# EAGLE design Slave Mux (EAGLE 9.6.2)
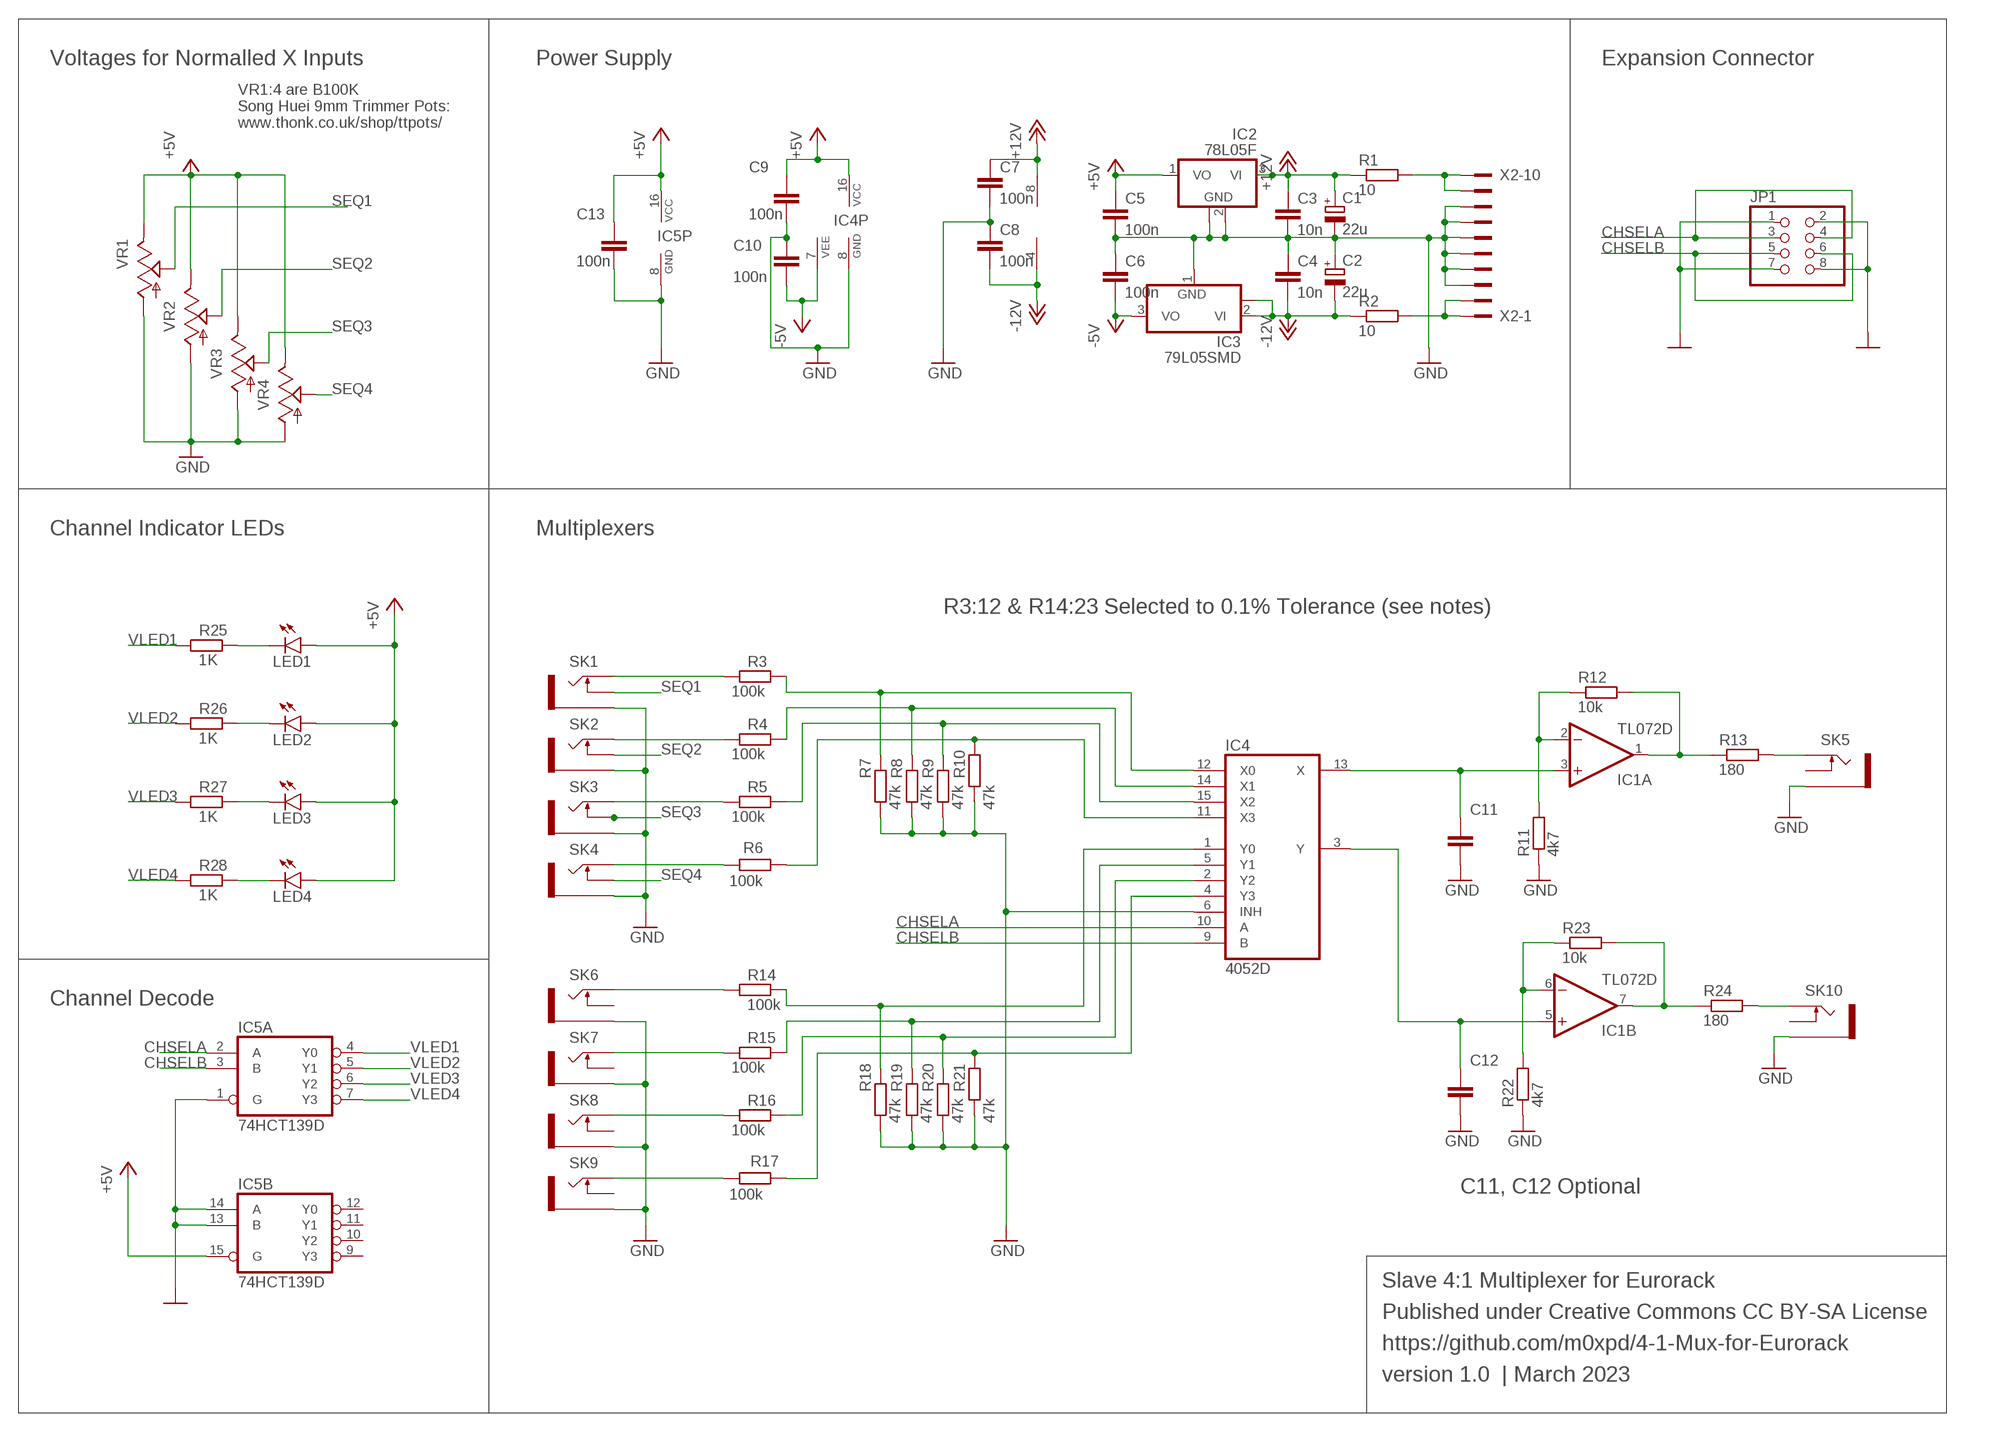
[diagram p0: schematic, sheet 1]

## Parts
C1  22u  CPOL-EU153CLV-0505  [153CLV-0505]
C2  22u  CPOL-EU153CLV-0505  [153CLV-0505]
C3  10n  C-EUC1206  [C1206]
C4  10n  C-EUC1206  [C1206]
C5  100n  C-EUC1206  [C1206]
C6  100n  C-EUC1206  [C1206]
C7  100n  C-EUC1206  [C1206]
C8  100n  C-EUC1206  [C1206]
C9  100n  C-EUC1206  [C1206]
C10  100n  C-EUC1206  [C1206]
C11  C-EUC1206  [C1206]
C12  C-EUC1206  [C1206]
C13  100n  C-EUC1206  [C1206]
IC1  TL072D  [SO08]
IC2  78L05F  [SOT89]
IC3  79L05SMD  [SOT89]
IC4  4052D  [SO16]
IC5  74HCT139D  [SO16]
JP1  PINHD-2X4  [2X04]
LED1  LED3MM  [LED3MM]
LED2  LED3MM  [LED3MM]
LED3  LED3MM  [LED3MM]
LED4  LED3MM  [LED3MM]
R1  10  R-EU_M1206  [M1206]
R2  10  R-EU_M1206  [M1206]
R3  100k  R-EU_M1206  [M1206]
R4  100k  R-EU_M1206  [M1206]
R5  100k  R-EU_M1206  [M1206]
R6  100k  R-EU_M1206  [M1206]
R7  47k  R-EU_M1206  [M1206]
R8  47k  R-EU_M1206  [M1206]
R9  47k  R-EU_M1206  [M1206]
R10  47k  R-EU_M1206  [M1206]
R11  4k7  R-EU_R1206  [R1206]
R12  10k  R-EU_R1206  [R1206]
R13  180  R-EU_M1206  [M1206]
R14  100k  R-EU_M1206  [M1206]
R15  100k  R-EU_M1206  [M1206]
R16  100k  R-EU_M1206  [M1206]
R17  100k  R-EU_M1206  [M1206]
R18  47k  R-EU_M1206  [M1206]
R19  47k  R-EU_M1206  [M1206]
R20  47k  R-EU_M1206  [M1206]
R21  47k  R-EU_M1206  [M1206]
R22  4k7  R-EU_R1206  [R1206]
R23  10k  R-EU_R1206  [R1206]
R24  180  R-EU_M1206  [M1206]
R25  1K  R-EU_M1206  [M1206]
R26  1K  R-EU_M1206  [M1206]
R27  1K  R-EU_M1206  [M1206]
R28  1K  R-EU_M1206  [M1206]
SK1  THONKICONN_JACK  [WQP-PJ301M-12_JACK]
SK2  THONKICONN_JACK  [WQP-PJ301M-12_JACK]
SK3  THONKICONN_JACK  [WQP-PJ301M-12_JACK]
SK4  THONKICONN_JACK  [WQP-PJ301M-12_JACK]
SK5  THONKICONN_JACK  [WQP-PJ301M-12_JACK]
SK6  THONKICONN_JACK  [WQP-PJ301M-12_JACK]
SK7  THONKICONN_JACK  [WQP-PJ301M-12_JACK]
SK8  THONKICONN_JACK  [WQP-PJ301M-12_JACK]
SK9  THONKICONN_JACK  [WQP-PJ301M-12_JACK]
SK10  THONKICONN_JACK  [WQP-PJ301M-12_JACK]
VR1  9MM_VERTICAL_POT  [9MM_SNAP-IN_POT]
VR2  9MM_VERTICAL_POT  [9MM_SNAP-IN_POT]
VR3  9MM_VERTICAL_POT  [9MM_SNAP-IN_POT]
VR4  9MM_VERTICAL_POT  [9MM_SNAP-IN_POT]
X2  2510-  [PAK100/2500-10]

## Nets
+5V: C5.1 C9.1 C13.1 IC2.1(VO) IC4.16(VCC) IC5.15(B:G) IC5.16(P:VCC) LED1.A LED2.A LED3.A LED4.A VR1.3(E) VR2.3(E) VR3.3(E) VR4.3(E)
+12V: C1.+ C3.1 C7.1 IC1.8(P:V+) IC2.3(VI) R1.1
-5V: C6.2 C10.2 IC3.3(VO) IC4.7(VEE)
-12V: C2.- C4.2 C8.2 IC1.4(P:V-) IC3.2(VI) IC3.2@1(VI) R2.1
CHSELA: IC4.10(A) IC5.2(A:A) JP1.3 JP1.4
CHSELB: IC4.9(B) IC5.3(A:B) JP1.5 JP1.6
GND: C1.- C2.+ C3.2 C4.1 C5.2 C6.1 C7.2 C8.1 C9.2 C10.1 C11.2 C12.2 C13.2 IC2.2(GND) IC2.2@1(GND) IC3.1(GND) IC4.6(INH) IC4.8(GND) IC5.1(A:G) IC5.8(P:GND) IC5.13(B:B) IC5.14(B:A) JP1.1 JP1.2 JP1.7 JP1.8 R7.1 R8.1 R9.1 R10.1 R11.1 R18.1 R19.1 R20.1 R21.1 R22.1 SK1.P$3_SLEEVE(SLEEVE) SK2.P$3_SLEEVE(SLEEVE) SK3.P$3_SLEEVE(SLEEVE) SK4.P$3_SLEEVE(SLEEVE) SK5.P$3_SLEEVE(SLEEVE) SK6.P$3_SLEEVE(SLEEVE) SK7.P$3_SLEEVE(SLEEVE) SK8.P$3_SLEEVE(SLEEVE) SK9.P$3_SLEEVE(SLEEVE) SK10.P$3_SLEEVE(SLEEVE) VR1.1(A) VR2.1(A) VR3.1(A) VR4.1(A) X2.3 X2.4 X2.5 X2.6 X2.7 X2.8
N$1: IC4.12(X0) R3.2 R7.2
N$2: IC4.14(X1) R4.2 R8.2
N$3: IC4.15(X2) R5.2 R9.2
N$4: C11.1 IC1.3(A:+IN) IC4.13(X)
N$5: IC1.2(A:-IN) R11.2 R12.1
N$6: IC1.1(A:OUT) R12.2 R13.1
N$7: R3.1 SK1.P$1_TIP(TIP)
N$8: IC4.11(X3) R6.1 R10.2
N$9: R4.1 SK2.P$1_TIP(TIP)
N$10: R5.1 SK3.P$1_TIP(TIP)
N$11: R6.2 SK4.P$1_TIP(TIP)
N$12: LED1.K(C) R25.2
N$13: R13.2 SK5.P$1_TIP(TIP)
N$14: IC4.1(Y0) R14.2 R18.2
N$15: R1.2 X2.9 X2.10
N$16: R2.2 X2.1 X2.2
N$17: IC4.5(Y1) R15.2 R19.2
N$18: IC4.2(Y2) R16.2 R20.2
N$19: IC4.4(Y3) R17.1 R21.2
N$20: R14.1 SK6.P$1_TIP(TIP)
N$21: R15.1 SK7.P$1_TIP(TIP)
N$22: R16.1 SK8.P$1_TIP(TIP)
N$23: R17.2 SK9.P$1_TIP(TIP)
N$24: LED4.K(C) R28.2
N$25: C12.1 IC1.5(B:+IN) IC4.3(Y)
N$26: IC1.6(B:-IN) R22.2 R23.1
N$27: IC1.7(B:OUT) R23.2 R24.1
N$28: R24.2 SK10.P$1_TIP(TIP)
N$29: LED2.K(C) R26.2
N$30: LED3.K(C) R27.2
SEQ1: SK1.P$2_SWITCH(SWITCH) VR1.2(S)
SEQ2: SK2.P$2_SWITCH(SWITCH) VR2.2(S)
SEQ3: SK3.P$2_SWITCH(SWITCH) VR3.2(S)
SEQ4: SK4.P$2_SWITCH(SWITCH) VR4.2(S)
VLED1: IC5.4(A:Y0) R25.1
VLED2: IC5.5(A:Y1) R26.1
VLED3: IC5.6(A:Y2) R27.1
VLED4: IC5.7(A:Y3) R28.1
Unconnected: IC5.9(B:Y3) IC5.10(B:Y2) IC5.11(B:Y1) IC5.12(B:Y0) SK5.P$2_SWITCH(SWITCH) SK6.P$2_SWITCH(SWITCH) SK7.P$2_SWITCH(SWITCH) SK8.P$2_SWITCH(SWITCH) SK9.P$2_SWITCH(SWITCH) SK10.P$2_SWITCH(SWITCH)

## Notes on the sheet
- Voltages for Normalled X Inputs | Power Supply | Expansion Connector
- VR1:4 are B100K
  Song Huei 9mm Trimmer Pots:
  www.thonk.co.uk/shop/ttpots/
- Channel Indicator LEDs | Multiplexers
- R3:12 & R14:23 Selected to 0.1% Tolerance (see notes)
- Channel Decode
- C11, C12 Optional
- Slave 4:1 Multiplexer for Eurorack
- Published under Creative Commons CC BY-SA License
- https://github.com/m0xpd/4-1-Mux-for-Eurorack
- version 1.0  | March 2023

## Library data of the parts
C1 C2 = rcl:CPOL-EU: POLARIZED CAPACITOR, European symbol; SPICEPREFIX: C
C3-C13 = rcl:C-EU: CAPACITOR, European symbol; SPICEPREFIX: C
IC1 = linear:TL072: OP AMP
IC2 = linear:78L*: POSITOIV-VOLTAGE REGULATORS Output up to 100 mA Source: Datasheet <http://focus.ti.com/lit/ds/symlink/ua78l05.pdf>
IC3 = MyLibrary:79L05SMD: -5V Linear Regulator with 100mA output in SOT-89 Package
IC4 = 40xx:4052: Dual 4-channel ANALOG MULTIPLEXER
IC5 = 74xx-eu:74*139: Dual 2-line to 4-line DECODER/DEMULTIPLEXER
JP1 = pinhead:PINHD-2X4: PIN HEADER
LED1-LED4 = led:LED: LED OSRAM: - CHIPLED LG R971, LG N971, LY N971, LG Q971, LY Q971, LO R971, LY R971 LH N974, LH R974 LS Q976, LO Q976, LY Q976 LO Q996 - Hyper CHIPLED LW Q18S LB Q993, LB Q99A, LB R99A - SideLED LS A670, LO A670, LY A670, LG A670, LP A670 LB A673, LV A673, LT A673, LW A673 LH A674 LY A675 LS A676, LA A676, LO A676, LY A676, LW A676 LS A679, LY A679, LG A679 - Hyper Micro SIDELED® LS Y876, LA Y876, LO Y876, LY Y876 LT Y87S - SmartLED LW L88C, LW L88S LB L89C, LB L89S, LG L890 LS L89K, LO L89K, LY L89K LS L896, LA L896, LO L896, LY L896 - TOPLED LS T670, LO T670, LY T670, LG T670, LP T670 LSG T670, LSP T670, LSY T670, LOP T670, LYG T670 LG T671, LOG T671, LSG T671 LB T673, LV T673, LT T673, LW T673 LH T674 LS T676, LA T676, LO T676, LY T676, LB T676, LH T676, LSB T676, LW T676 LB T67C, LV T67C, LT T67C, LS T67K, LO T67K, LY T67K, LW E67C LS E67B, LA E67B, LO E67B, LY E67B, LB E67C, LV E67C, LT E67C LW T67C LS T679, LY T679, LG T679 LS T770, LO T770, LY T770, LG T770, LP T770 LB T773, LV T773, LT T773, LW T773 LH T774 LS E675, LA E675, LY E675, LS T675 LS T776, LA T776, LO T776, LY T776, LB T776 LHGB T686 LT T68C, LB T68C - Hyper Mini TOPLED® LB M676 - Mini TOPLED Santana® LG M470 LS M47K, LO M47K, LY M47K Source: http://www.osram.convergy.de LUXEON: - LUMILED® LXK2-PW12-R00, LXK2-PW12-S00, LXK2-PW14-U00, LXK2-PW14-V00 LXK2-PM12-R00, LXK2-PM12-S00, LXK2-PM14-U00 LXK2-PE12-Q00, LXK2-PE12-R00, LXK2-PE12-S00, LXK2-PE14-T00, LXK2-PE14-U00 LXK2-PB12-K00, LXK2-PB12-L00, LXK2-PB12-M00, LXK2-PB14-N00, LXK2-PB14-P00, LXK2-PB14-Q00 LXK2-PR12-L00, LXK2-PR12-M00, LXK2-PR14-Q00, LXK2-PR14-R00 LXK2-PD12-Q00, LXK2-PD12-R00, LXK2-PD12-S00 LXK2-PH12-R00, LXK2-PH12-S00 LXK2-PL12-P00, LXK2-PL12-Q00, LXK2-PL12-R00 Source: www.luxeon.com KINGBRIGHT: KA-3528ASYC Source: www.kingbright.com
R1-R28 = rcl:R-EU_: RESISTOR, European symbol; SPICEPREFIX: R
SK1-SK10 = MyLibrary:THONKICONN_JACK
VR1-VR4 = MyLibrary:9MM_VERTICAL_POT
X2 = con-3m:2510-: 3M (TM) Pak 100 4-Wall Header Source: 3M; MF: 3M; MPN: 2510-6002UB; OC_FARNELL: 9838244; OC_NEWARK: 46F4725

## Board
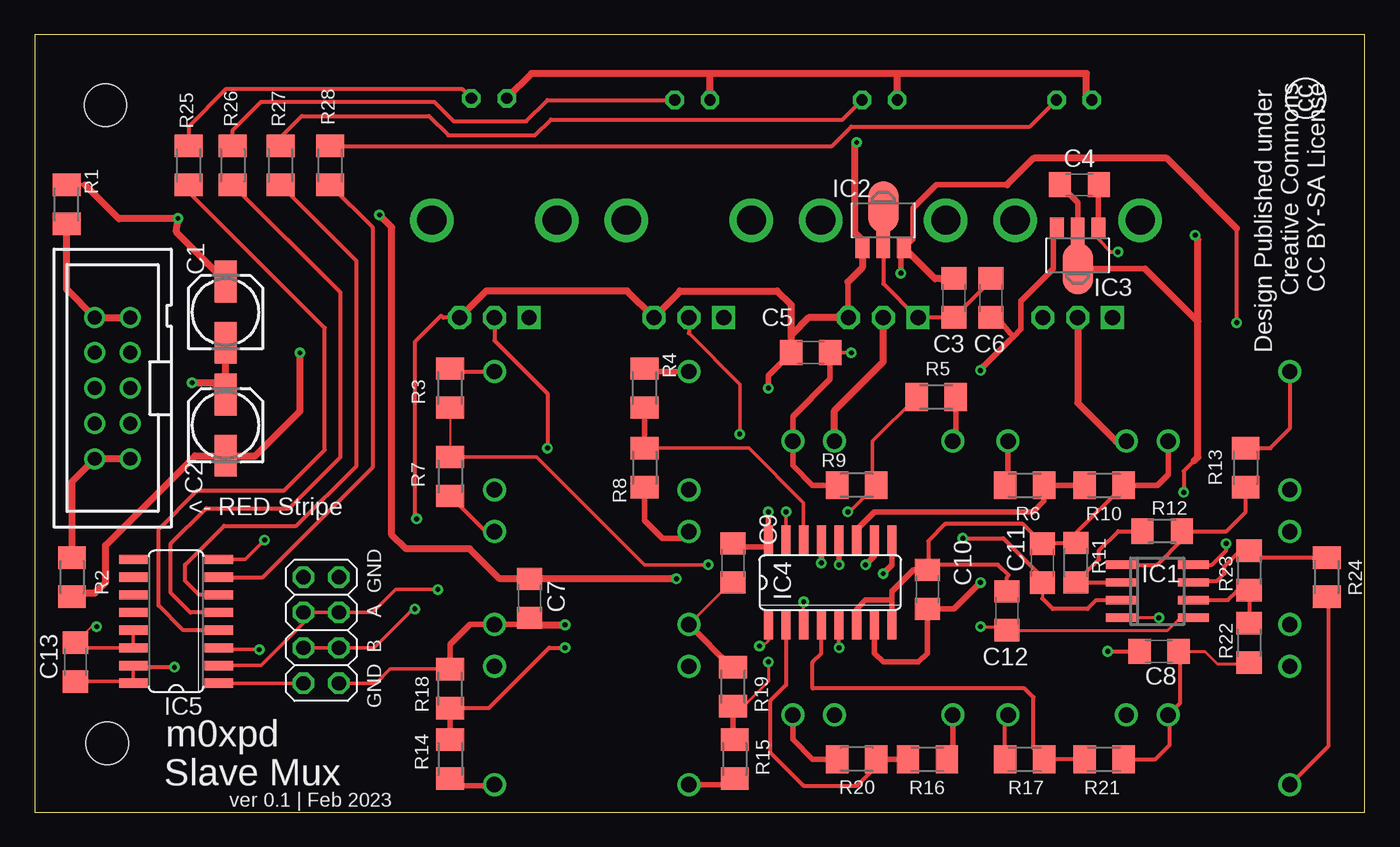
[diagram p1: board, top side]
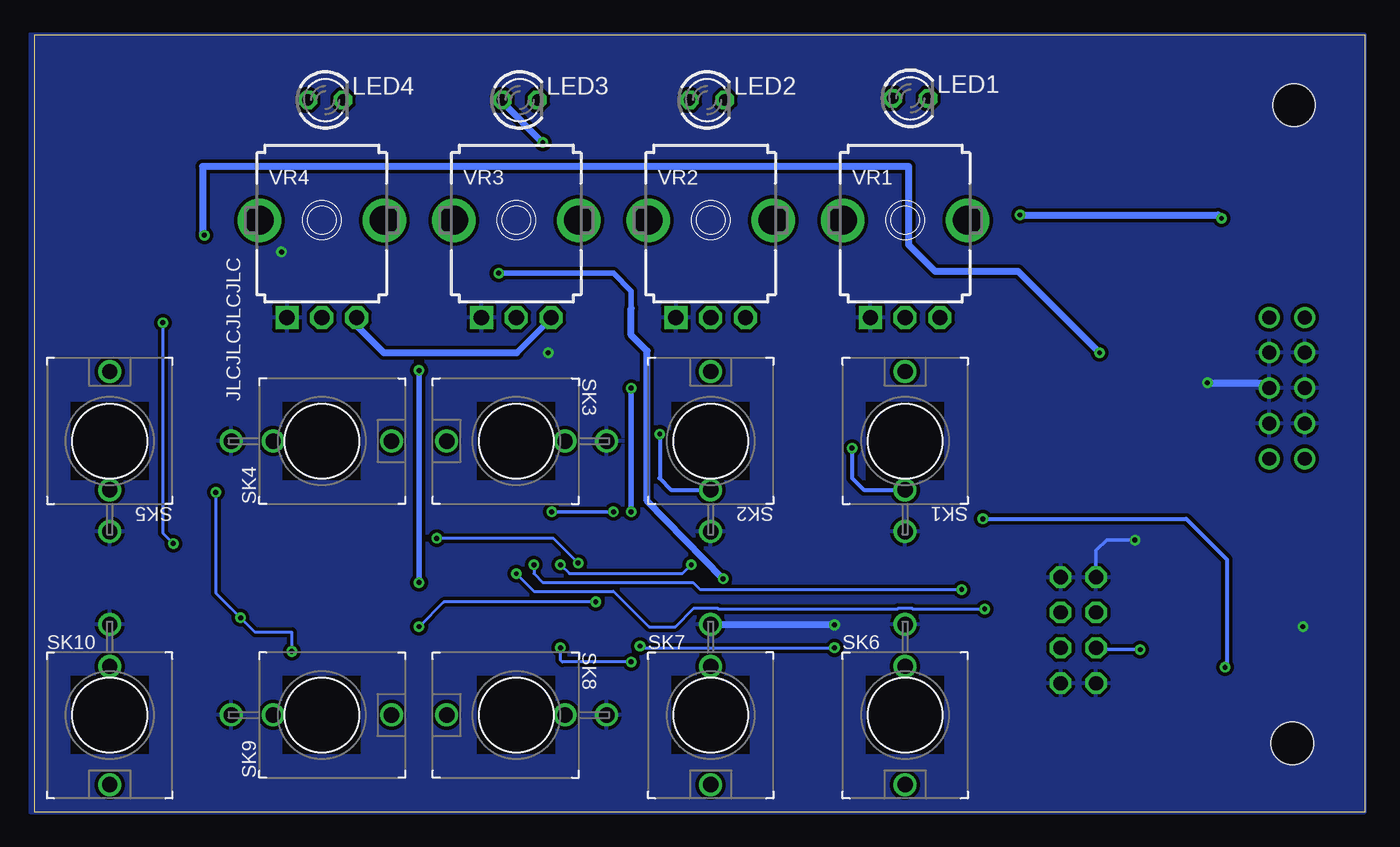
[diagram p2: board, bottom side, seen from below]

Size 95.56 x 55.87 mm. Coordinates in mm from the lower left corner, seen from the top.
Outline: 0,0 95.56,0 95.56,55.87 0,55.87 0,0
Copper layers (1*16): Top 0.035mm / dielectric 1.5mm / Bottom 0.035mm
Design rules "default *": minimum track width 6mil, minimum drill 0.35mm, track to track 10mil, track to pad 10mil, pad to pad 6mil, via to via 6mil, smd to smd 6mil, copper to edge 0mil, drill to drill 6mil, minimum pad ring 10mil, minimum via ring 8mil, stop-mask expansion 4mil, vias tented up to drill 0mil, thermal gap 10mil
Holes 3.05 mm at 5.21,4.95 5.08,50.8

### Footprints (pad centres in the part's own frame; a part is rotated, then mirrored left to right if it is on the bottom)
153CLV-0505 = smd 3 x 1.6: + 2.2,0; - -2.2,0
C1206 = smd 1.6 x 1.8: 1 -1.4,0; 2 1.4,0
SO08 = smd 0.6 x 2.2: 1 -1.905,-2.6; 2 -0.635,-2.6; 3 0.635,-2.6; 4 1.905,-2.6; 5 1.905,2.6; 6 0.635,2.6; 7 -0.635,2.6; 8 -1.905,2.6
SOT89 = smd 1 x 1.5: 1 -1.499,-1.981; 3 1.499,-1.981 | smd 1 x 2: 2 0,-1.727 | smd 2.2 x 3.7: 2@1 0,0.94
SO16 = smd 0.66 x 2.032: 1 -4.445,-3.073; 2 -3.175,-3.073; 3 -1.905,-3.073; 4 -0.635,-3.073; 5 0.635,-3.073; 6 1.905,-3.073; 7 3.175,-3.073; 8 4.445,-3.073; 9 4.445,3.073; 10 3.175,3.073; 11 1.905,3.073; 12 0.635,3.073; 13 -0.635,3.073; 14 -1.905,3.073; 15 -3.175,3.073; 16 -4.445,3.073
2X04 = drill 1.016 octagon: 1 -3.81,-1.27; 2 -3.81,1.27; 3 -1.27,-1.27; 4 -1.27,1.27; 5 1.27,-1.27; 6 1.27,1.27; 7 3.81,-1.27; 8 3.81,1.27
LED3MM = drill 0.813 octagon: A -1.27,0; K 1.27,0
M1206 = smd 1.6 x 2: 1 -1.4,0; 2 1.4,0
R1206 = smd 1.6 x 1.803: 1 -1.422,0; 2 1.422,0
WQP-PJ301M-12_JACK = drill 1.1: P$1_TIP 0,5; P$2_SWITCH 0,-3.5; P$3_SLEEVE 0,-6.5
9MM_SNAP-IN_POT = drill 1.1 square: 1 -2.5,-7 | drill 1.1 octagon: 2 0,-7; 3 2.5,-7 | drill 2.1 pad 2.794: CH1 -4.5,0; CH2 4.5,0
PAK100/2500-10 = drill 1 pad 1.422: 1 -5.08,-1.27; 2 -5.08,1.27; 3 -2.54,-1.27; 4 -2.54,1.27; 5 0,-1.27; 6 0,1.27; 7 2.54,-1.27; 8 2.54,1.27; 9 5.08,-1.27; 10 5.08,1.27

### Placement (x,y rotation side)
C1  13.72,35.94 90 top
C2  13.72,27.81 90 top
C3  66.04,36.96 270 top
C4  75.06,45.09 180 top
C5  55.75,33.02 0 top
C6  68.71,36.96 270 top
C7  35.56,15.37 270 top
C8  80.78,11.56 180 top
C9  50.16,17.91 270 top
C10  64.14,16 270 top
C11  72.39,17.9 90 top
C12  69.85,14.47 90 top
C13  2.92,10.79 90 top
IC1  80.64,15.88 270 top
IC2  60.96,42.55 0 top
IC3  74.93,40.01 180 top
IC4  57.15,16.51 0 top
IC5  10.16,13.72 90 top
JP1  20.57,13.08 270 top
LED1  32.64,51.31 0 bottom
LED2  47.24,51.18 0 bottom
LED3  60.71,51.18 0 bottom
LED4  74.68,51.18 0 bottom
R1  2.29,43.69 270 top
R2  2.67,16.89 90 top
R3  29.84,30.48 270 top
R4  43.81,30.48 270 top
R5  64.77,29.84 180 top
R6  71.12,23.5 180 top
R7  29.84,24.13 90 top
R8  43.81,24.77 90 top
R9  59.05,23.5 0 top
R10  76.83,23.5 180 top
R11  74.8,17.93 270 top
R12  81,20.19 0 top
R13  87,24.77 90 top
R14  29.84,3.81 90 top
R15  50.29,3.81 90 top
R16  64.14,3.81 180 top
R17  71.12,3.81 180 top
R18  29.84,8.89 270 top
R19  50.16,9.02 270 top
R20  59.05,3.81 0 top
R21  76.83,3.81 180 top
R22  87.25,12.17 90 top
R23  87.25,17.37 90 top
R24  92.84,16.89 270 top
R25  11.05,46.48 90 top
R26  14.22,46.48 90 top
R27  17.65,46.48 90 top
R28  21.21,46.48 90 top
SK1  33.02,26.67 0 bottom
SK2  46.99,26.67 0 bottom
SK3  60.96,26.67 90 bottom
SK4  74.93,26.67 270 bottom
SK5  90.17,26.67 0 bottom
SK6  33.02,6.99 180 bottom
SK7  46.99,6.99 180 bottom
SK8  60.96,6.99 90 bottom
SK9  74.93,6.99 270 bottom
SK10  90.17,6.99 180 bottom
VR1  33.02,42.55 0 bottom
VR2  46.99,42.55 0 bottom
VR3  60.96,42.55 0 bottom
VR4  74.93,42.55 0 bottom
X2  5.59,30.48 90 top

### Tracks (layer width: path | path; a pad name or v marks a point on that pad's centre or on a via)
+5V  (via drill 0.35)
  Top 0.254: C13.1 6.96,9.39 IC5.16 7.09,10.41 IC5.15
  Top 0.305: VR1.3 29.35,35.55 29.21,35.69 27.3,33.78 27.3,21.08 | v10.03,10.41 7.09,10.41
  Top 0.406: 58.42,38.1 58.42,35.59 VR3.3 | C5.1 52.7,31.38 v52.7,30.48 | 52.7,19.94 v52.7,21.59 | C9.1 50.42,19.05 52.7,19.05
  Top 0.508: VR3.3 55.6,35.55 54.35,34.29 C5.1 54.35,36.45 53.34,37.47 46.35,37.47 46.35,37.41 VR2.3 42.57,37.47 32.44,37.47 VR1.3 | 58.42,38.1 59.46,39.14 IC2.1 59.46,41.12 58.93,41.66 58.93,48.13 v59.05,48.13 | 52.7,19.94 IC4.16 52.7,19.05 | LED4.A 75.56,51.56 75.56,53.09 61.98,53.09 | 61.98,53.09 48.39,53.09 | 48.39,53.09 35.69,53.09 LED1.A | LED2.A 48.51,52.96 48.39,53.09 | LED3.A 61.98,53.09 | 27.3,21.08 v27.43,21.08
  Bottom 0.305: v27.43,21.08 12.83,21.08 9.91,18.16 9.91,10.41
  Bottom 0.406: 60.91,33.02 58.46,35.47 VR3.3 | v52.7,21.59 v52.7,30.48
  Bottom 0.508: VR4.3 72.43,34.97 70.48,33.02 60.91,33.02 | v59.05,48.13 61.98,51.05 LED3.A | 9.91,10.41 v10.03,10.41
+12V  (via drill 0.35)
  Top 0.152: 62.23,40.34 IC2.3
  Top 0.254: R1.1 3.59,45.09
  Top 0.305: 86.36,41.95 v86.36,35.18 86.36,34.92 | IC1.8 84.58,17.78 85.6,18.8 v85.6,19.3
  Top 0.406: 69.85,45.09 64.77,45.09 63.09,43.41 63.09,41.2 IC2.3 | v62.23,38.73 62.23,40.34
  Top 0.508: 69.85,45.09 71.75,46.99 81.32,46.99 86.36,41.95 | IC2.3 64.68,38.34 65.02,38.36 C3.1 | v46.09,16.77 C7.1 33.4,16.77 31.24,18.92 26.67,18.92 25.65,19.94 25.65,42.04 v24.77,42.93 | 3.59,45.09 6.03,42.65 6.05,42.67 v10.29,42.67 10.16,41.7 C1.+
  Bottom 0.203: v86.36,35.18 86.36,20.07 v85.6,19.3
  Bottom 0.406: 52.7,36.2 52.7,37.47 53.98,38.73 v62.23,38.73
  Bottom 0.508: 52.7,36.2 52.7,34.29 51.56,33.15 51.56,22.37 v46.09,16.77 | v24.77,42.93 10.54,42.93 v10.29,42.67
-5V  (via drill 0.35)
  Top 0.406: IC3.3 73.18,41.73 73.18,39.06 70.88,36.77 70.87,36.78 70.87,34.72 70.3,34.16 | C6.2 69.19,35.48 70.3,34.16 | v67.94,16.51 66.04,14.61 C10.2 64.14,11.43 63.5,10.79 60.96,10.79 60.33,11.43 IC4.7 | 70.3,34.16 70.08,33.93 67.94,31.8 v67.94,31.75
  Bottom 0.406: v67.94,16.51 v67.94,31.75
-12V  (via drill 0.35)
  Top 0.203: v82.55,22.99 82.55,22.86 | v80.77,13.97 IC1.4
  Top 0.305: 83.31,25.27 82.55,24.51 v82.55,22.99 | v77.09,11.56 C8.2
  Top 0.406: 79.77,39.06 IC3.2@1 IC3.2 74.93,43.81 C4.2
  Top 0.508: 83.31,25.27 83.57,25.53 83.57,35.27 | 79.77,39.06 83.57,35.27 | 83.57,35.27 83.57,41.15 83.31,41.4 v83.38,41.47 | R2.1 2.92,15.75 4.32,15.75 5.08,16.51 5.08,19.18 11.52,25.61 C2.- 15.83,25.61 19.05,28.83 v19.05,33.02
  Bottom 0.203: v82.55,22.99 82.55,15.75 v80.77,13.97 79.76,12.95 77.09,12.95 v77.09,11.56
  Bottom 0.508: v83.38,41.47 83.5,41.59 83.5,46.42 32.77,46.42 32.77,40.77 30.86,38.86 24.89,38.86 v19.05,33.02
CHSELA  (via drill 0.35)
  Top 0.254: IC5.2 16.26,10.54 19.3,13.59 JP1.3 JP1.4 24.26,14.35 25.91,16 v28.96,16
  Top 0.406: IC4.10 60.33,18.41 v59.69,17.78
  Bottom 0.203: v59.69,17.78 59.69,17.14 59.05,16.51 48.26,16.51 47.75,16 v28.96,16
CHSELB  (via drill 0.35)
  Top 0.254: IC5.3 13.36,11.68 v16.13,11.68 | JP1.5 JP1.6 24.38,11.81 27.18,14.61 v27.3,14.61
  Top 0.406: IC4.9 61.59,17.78 v60.96,17.14
  Bottom 0.203: v60.96,17.14 59.69,15.88 53.98,15.88 51.44,13.34 49.53,13.34 48.2,14.67 46.5,14.67 46.44,14.61 33.57,14.61 33.51,14.67 32.53,14.67 32.47,14.61 v27.3,14.61
  Bottom 0.254: JP1.5 19.18,11.68 v16.13,11.68
GND  (via drill 0.35)
  Top 0.152: C3.2 66.03,35.55 | 68.2,37.72 68.2,38.1 68.46,38.36 C6.1 | C7.2 36.07,13.46 | C13.2 4.06,13.34 v4.45,13.34
  Top 0.203: SK7.P$3_SLEEVE 50.02,16.51 C9.2 | C11.2 72.44,19.35 | 74.8,20.06 R11.1 | 69.85,16.89 69.98,17.02 | 64.38,17.78 64.19,17.59 64.01,17.41 | C8.1 82.3,11.56 84.07,11.56 84.96,10.67 87.17,10.67 R22.1 | SK9.P$3_SLEEVE 81.55,7.1
  Top 0.254: 63.39,35.55 VR3.1 | C5.2 v58.67,33.02 | IC5.8 15.11,18.16 v16.51,19.56 | JP1.8 24.51,9.27 25.53,10.29 R18.1 | C13.2 3.31,11.81 IC5.14 IC5.13 | JP1.7 IC5.1 | IC3.1 76.43,41.17 77.33,40.27 v77.83,40.26
  Top 0.305: R7.1 32.41,20.17 SK1.P$3_SLEEVE | 72.44,19.35 R11.1 | R10.1 74.8,20.06 | C12.2 69.85,16.89 | 69.98,17.02 69.22,17.78 64.38,17.78 | C11.2 70.99,20.7 65.41,20.7 64.19,19.49 64.19,17.59 | 82.3,11.56 82.3,7.85 81.55,7.1 81.55,4.84 80.52,3.81 R21.1 | IC2.2 60.96,37.97 63.39,35.55 66.03,35.55 | C3.2 68.2,37.72
  Top 0.406: IC3.1 76.43,45.05 C4.1 | IC4.8 61.59,15.24 | 61.59,15.24 61.59,15.88 63.12,17.41 64.01,17.41 C10.1 | R18.1 29.84,12.06 31.27,13.48 SK6.P$3_SLEEVE 34.86,13.48 C7.2 | SK7.P$3_SLEEVE 50.06,10.42 R19.1 | R20.1 55.88,3.81 54.46,5.23 SK8.P$3_SLEEVE | IC4.6 59.05,14.61 59.69,15.24 61.59,15.24 | R8.1 43.81,20.95 45.09,19.68 46.51,19.68 SK2.P$3_SLEEVE | R9.1 55.88,23.5 54.46,24.91 SK3.P$3_SLEEVE 54.46,28.43 57.15,31.11 C5.2 | R10.1 80.64,23.5 81.43,24.28 SK4.P$3_SLEEVE | IC2.2 IC2.2@1
  Top 0.508: 36.07,13.46 v38.1,13.46 | C1.- C2.+ 12.87,30.86 v11.3,30.86
  Bottom 0.152: 46.97,13.46 SK7.P$3_SLEEVE
  Bottom 0.254: v16.51,19.56 18.54,19.56 19.3,18.8 JP1.1
  Bottom 0.508: v38.1,13.46 46.97,13.46 | v11.3,30.86 7.24,30.86 X2.5
  pour Bottom: 0,0 0,55.88 95.89,55.88 95.89,0
N$1  (via drill 0.35)
  Top 0.152: R3.2 R7.2
  Top 0.254: R7.2 36.06,25.53 43.81,17.78 v48.39,17.78
  Top 0.406: v57.78,17.78 IC4.12
  Bottom 0.203: v48.39,17.78 49.02,17.14 57.15,17.14 v57.78,17.78
N$2
  Top 0.254: IC4.14 55.24,22.23 51.3,26.16 R8.2
  Top 0.406: R4.2 R8.2
N$3  (via drill 0.35)
  Top 0.254: R5.2 60.2,26.67 60.2,23.23 | IC4.15 v53.98,21.59 | R9.2 58.55,21.59
  Top 0.406: 60.2,23.23 R9.2 | v58.42,21.59 58.55,21.59
  Bottom 0.254: v53.98,21.59 v58.42,21.59
N$4  (via drill 0.35)
  Top 0.203: 72.39,16.89 C11.1 72.39,15.36
  Top 0.305: 72.39,16.89 69.59,19.68 v66.67,19.68 | 72.39,15.36 73.15,14.61 75.63,14.61 76.27,15.24 IC1.3
  Top 0.406: IC4.13 v56.52,17.91
  Bottom 0.203: v56.52,17.91 58.29,19.68 v66.67,19.68
N$5
  Top 0.305: IC1.2 R11.2 76.45,18.16 76.45,18.8 77.85,20.19 R12.1
N$6
  Top 0.203: R12.2 82.42,19.56
  Top 0.305: IC1.1 80.64,17.78 82.42,19.56 | R12.2 85.6,20.19 87,21.59 R13.1
N$7
  Top 0.152: R3.1 30.05,31.67
  Top 0.305: 30.05,31.67 SK1.P$1_TIP
N$8
  Top 0.406: R10.2 R6.1 72.52,22.36 71.75,21.59 60.33,21.59 59.05,20.32 IC4.11
N$9
  Top 0.406: SK2.P$1_TIP 44.02,31.67 R4.1
N$10
  Top 0.406: SK3.P$1_TIP 66.17,26.88 R5.1
N$11
  Top 0.406: SK4.P$1_TIP 69.93,23.7 R6.2
N$12
  Top 0.305: LED1.K 30.73,51.94 13.72,51.94 11.05,49.28 R25.2
N$13
  Top 0.305: SK5.P$1_TIP 90.17,27.56 88.78,26.16 R13.2
N$14  (via drill 0.35)
  Top 0.203: IC4.1 52.7,12.32 52.32,11.94 v52.07,11.94
  Top 0.305: R18.2 32.64,7.49 36.96,11.81 v38.1,11.81
  Top 0.406: R14.2 R18.2
  Bottom 0.203: v52.07,11.94 51.94,11.81 v38.1,11.81
N$15
  Top 0.508: X2.9 X2.10 2.29,37.59 R1.2
N$16
  Top 0.508: X2.1 X2.2 2.67,23.75 R2.2
N$17  (via drill 0.35)
  Top 0.203: R19.2 50.92,7.62 52.7,9.4 v52.7,10.79
  Top 0.305: v57.78,11.81 IC4.5
  Top 0.406: R15.2 50.16,5.34 R19.2
  Bottom 0.203: v52.7,10.79 57.66,10.79 57.78,10.92 v57.78,11.81
N$18
  Top 0.203: 60.45,3.31 R20.2
  Top 0.305: IC4.2 53.98,9.14 52.83,8 52.83,4.32 55.24,1.91 59.05,1.91 60.45,3.31
  Top 0.406: R16.2 R20.2
N$19
  Top 0.203: 72.39,3.94 71.75,4.58
  Top 0.254: R17.1 72.39,3.94
  Top 0.305: 71.75,4.58 71.75,8.26 71.12,8.89 55.88,8.89 55.88,10.79 56.52,11.43 IC4.4 | R21.2 R17.1
N$20
  Top 0.406: SK6.P$1_TIP 32.94,1.91 30.35,1.91 R14.1
N$21
  Top 0.406: SK7.P$1_TIP 49.87,1.99 R15.1
N$22
  Top 0.406: SK8.P$1_TIP 65.96,4.24 R16.1
N$23
  Top 0.305: R17.2 69.72,6.78 SK9.P$1_TIP
N$24
  Top 0.305: R28.2 57.28,47.88 58.67,49.28 71.5,49.28 LED4.K
N$25  (via drill 0.35)
  Top 0.203: IC4.3 v55.24,15.11 | v67.94,13.34 69.59,13.34 C12.1 81.4,13.07 82.3,13.97 IC1.5
  Bottom 0.203: v55.24,15.11 66.17,15.11 v67.94,13.34
N$26
  Top 0.203: R23.1 87.25,15.88
  Top 0.305: R22.2 87.25,15.88 86.36,15.88 85.72,15.24 IC1.6
N$27
  Top 0.203: 87.75,18.29 87.38,18.67 | 87.38,18.67 R23.2 | IC1.7 83.37,16.64 | 86.49,18.67 87.38,18.67
  Top 0.305: R24.1 87.75,18.29 | 83.37,16.64 84.96,16.64 85.47,17.14 85.47,17.65 86.49,18.67
N$28
  Top 0.203: 92.96,15.36 R24.2
  Top 0.305: SK10.P$1_TIP 92.96,4.78 92.96,15.36
N$29
  Top 0.305: R26.2 14.22,49.02 16.26,51.05 28.7,51.05 30.1,49.66 35.31,49.66 36.83,51.18 LED2.K
N$30
  Top 0.305: R27.2 17.65,48.52 19.17,50.04 28.32,50.04 29.72,48.64 35.94,48.64 37.08,49.78 58.04,49.78 LED3.K
SEQ1  (via drill 0.35)
  Top 0.305: v36.83,26.16 36.83,30.1 33.02,33.91 VR1.2
  Bottom 0.305: v36.83,26.16 36.83,24 36,23.17 SK1.P$2_SWITCH
SEQ2  (via drill 0.35)
  Top 0.254: 46.99,34.42 50.67,30.73 50.67,27.18
  Top 0.305: VR2.2 46.99,34.42 | 50.67,27.18 v50.65,27.18
  Bottom 0.305: v50.65,27.18 50.65,24.03 50.67,24 49.84,23.17 SK2.P$2_SWITCH
SEQ3
  Top 0.508: SK3.P$2_SWITCH 57.46,28.89 60.96,32.38 VR3.2
SEQ4
  Top 0.508: SK4.P$2_SWITCH 77.67,26.67 74.93,29.41 VR4.2
VLED1
  Top 0.305: R25.1 11.3,44.83 11.3,44.32 20.83,34.8 20.83,26.04 17.91,23.11 11.68,23.11 8.89,20.32 8.89,14.86 10.67,13.08 IC5.4
VLED2
  Top 0.305: R26.1 21.97,37.34 21.97,25.53 18.29,21.84 12.32,21.84 9.78,19.3 9.78,15.75 11.18,14.35 IC5.5
VLED3
  Top 0.305: R27.1 23.11,39.62 23.11,24.89 18.8,20.57 13.59,20.57 10.79,17.78 10.79,16.64 11.81,15.62 IC5.6
VLED4
  Top 0.305: IC5.7 16.38,16.89 24.26,24.77 24.26,42.03 R28.1

### Text on the board
tPlace: Design Published under / Creative Commons / CC BY-SA License | cc
tNames: <- RED Stripe | GND B A GND | m0xpd | Slave Mux | ver 0.1 | Feb 2023
bNames: JLCJLCJLCJLC